# Altium schematic sheet Pixracer_V1_FMU_Alternative_2.SchDoc
size 287 x 183 mm; Origin: Eagle
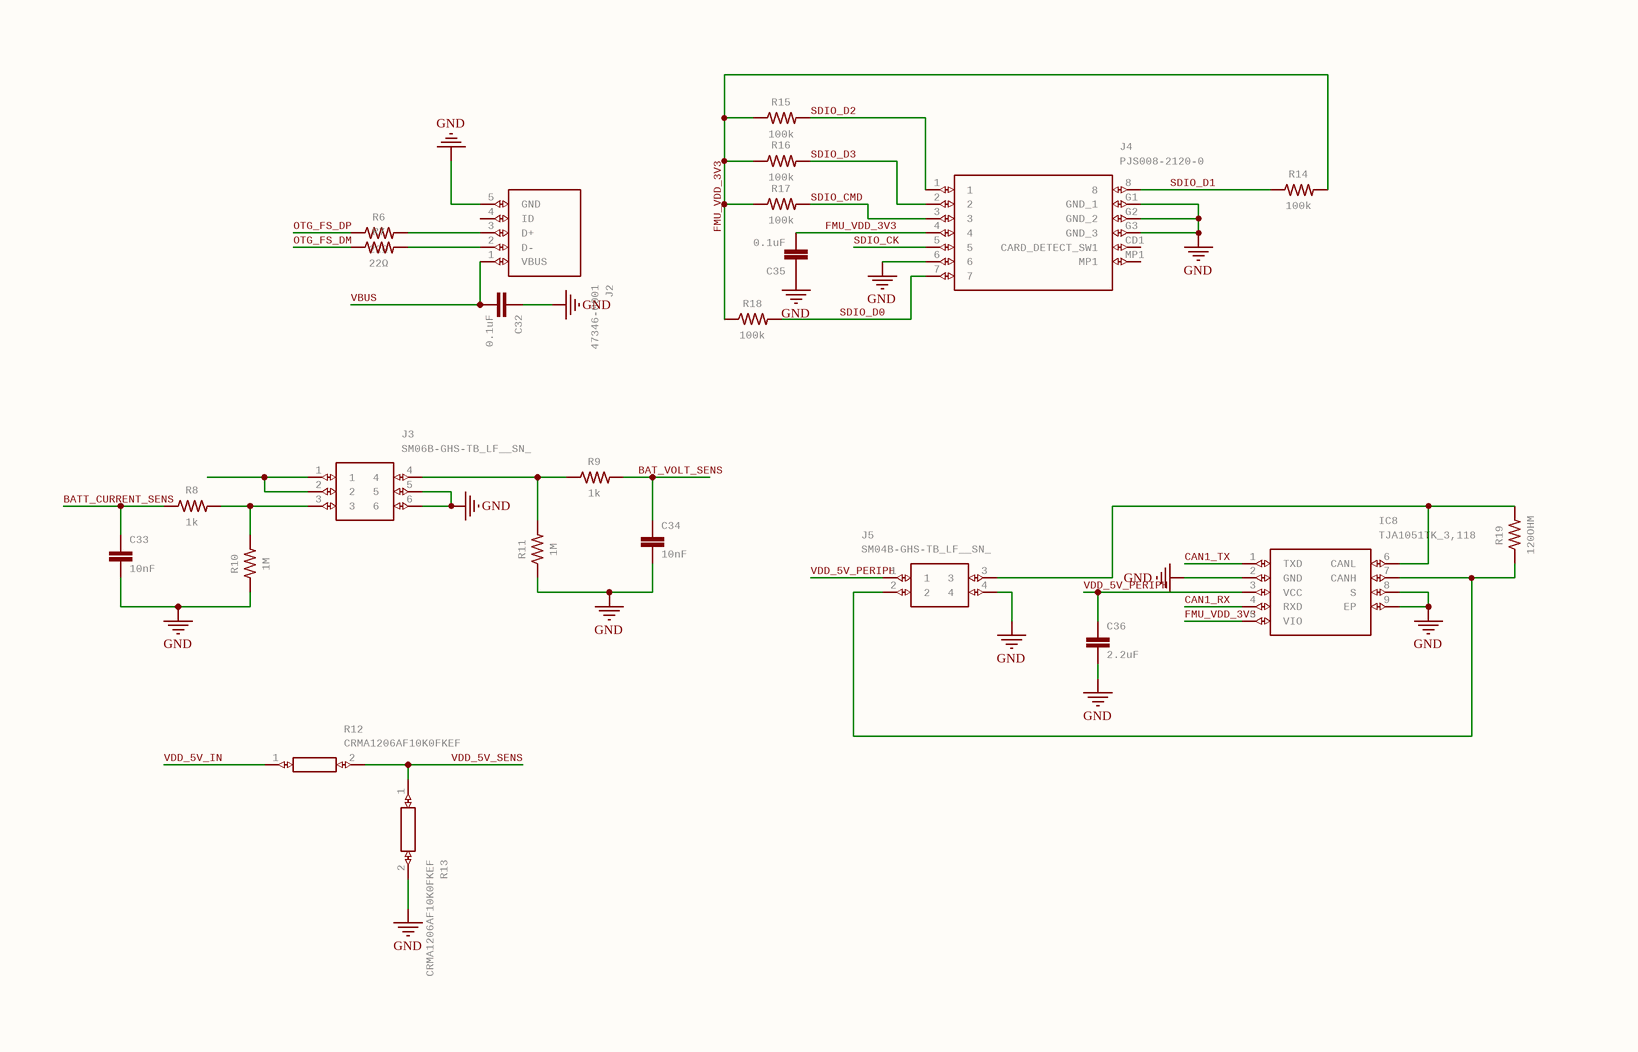
[diagram p0: Pixracer_V1_FMU_Alternative_2.SchDoc]

## Parts
C32  0.1uF  [0603]
C33  10nF  [0603]
C34  10nF  [0603]
C35  0.1uF  [0603]
C36  2.2uF  [1206]
IC8  TJA1051TK_3,118  [SON65P300X300X100-9N]
J2  47346-0001  [47346-0001]
J3  SM06B-GHS-TB_LF__SN_  [SM06B-GHS-TB]
J4  PJS008-2120-0  [PJS00821200]
J5  SM04B-GHS-TB_LF__SN_  [SM04B-GHS-TB]
R6  22Ω  [0603]
R7  22Ω  [0603]
R8  1k  [0603]
R9  1k  [0603]
R10  1M  [0603]
R11  1M  [0603]
R12  CRMA1206AF10K0FKEF  [RESC3216X74N]
R13  CRMA1206AF10K0FKEF  [RESC3216X74N]
R14  100k  [0603]
R15  100k  [0603]
R16  100k  [0603]
R17  100k  [0603]
R18  100k  [0603]
R19  120OHM  [0603]

## Nets
GND: C32.1 C33.2 C34.2 C35.1 C36.2 IC8.2(GND) IC8.8(S) IC8.9(EP) J2.5(GND) J3.5 J3.6 J4.6 J4.G1(GND_1) J4.G2(GND_2) J4.G3(GND_3) J5.4 R10.1 R11.1 R13.2
BAT_VOLT_SENS: C34.1 R9.2
BATT_CURRENT_SENS: C33.1 R8.1
CAN1_RX: IC8.4(RXD)
CAN1_TX: IC8.1(TXD)
FMU_VDD_3V3: C35.2 IC8.5(VIO) J4.4 R14.2 R15.1 R16.1 R17.1 R18.1
OTG_FS_DM: R7.1
OTG_FS_DP: R6.1
SDIO_CK: J4.5
SDIO_CMD: J4.3 R17.2
SDIO_D0: J4.7 R18.2
SDIO_D1: J4.8 R14.1
SDIO_D2: J4.1 R15.2
SDIO_D3: J4.2 R16.2
VBUS: C32.2 J2.1(VBUS)
VDD_5V_IN: R12.1
VDD_5V_PERIPH: C36.1 IC8.3(VCC) J5.1
VDD_5V_SENS: R12.2 R13.1
NetIC8_6: IC8.6(CANL) J5.3 R19.2
NetIC8_7: IC8.7(CANH) J5.2 R19.1
NetJ2_2: J2.2(D-) R7.2
NetJ2_3: J2.3(D+) R6.2
NetJ3_1: J3.1 J3.2
NetJ3_3: J3.3 R8.2 R10.2
NetJ3_4: J3.4 R9.1 R11.2

Not connected (* = marked no-connect by the designer): J2 4(ID); J4 CD1(CARD_DETECT_SW1) MP1

## Library data of the parts
C32 C35 = 0.1UF-0603-100V-10%-X7R-WE: 0.1ÂµF ceramic capacitors    A capacitor is a passive two-terminal electrical component used to store electrical energy temporarily in an electric field.; GateName_1: G$1; SymbolName_1: CAP; PROD_ID: CAP-16436; DeviceName: -0603-100V-10%-X7R-WE; LibraryName: SparkFun-Capacitors; DeviceSetName: 0.1UF
C33 C34 = 10NF-0603-50V-10%: 0.01uF/10nF/10,000pF ceramic capacitors    A capacitor is a passive two-terminal electrical component used to store electrical energy temporarily in an electric field.CAP-09321; GateName_1: G$1; SymbolName_1: CAP; PROD_ID: CAP-00867; DeviceName: -0603-50V-10%; LibraryName: SparkFun-Capacitors; DeviceSetName: 10NF
C36 = 2.2UF-1206-50V-10%: 2.2ÂµF ceramic capacitors    A capacitor is a passive two-terminal electrical component used to store electrical energy temporarily in an electric field.; GateName_1: G$1; SymbolName_1: CAP; PROD_ID: CAP-10009; DeviceName: -1206-50V-10%; LibraryName: SparkFun-Capacitors; DeviceSetName: 2.2UF
IC8 = TJA1051TK_3,118: High-speed CAN transceiver   Source:  Datasheet; MANUFACTURER_NAME: NXP; MANUFACTURER_PART_NUMBER: TJA1051TK/3,118; GateName_1: G$1; SymbolName_1: TJA1051TK_3,118; LibraryName: SamacSys_Parts; DeviceSetName: TJA1051TK_3,118; DESCRIPTION: High-speed CAN transceiver; HEIGHT: 1mm; MOUSER_PART_NUMBER: 771-TJA1051TK/3118; MOUSER_PRICE-STOCK: https://www.mouser.co.uk/ProductDetail/NXP-Semiconductors/TJA1051TK-3118?qs=fhAOlxDPaYVrDQ2e4g%252BBJA%3D%3D
J2 = 47346-0001: Micro USB B Receptacle Bottom Mount Assy Molex Right Angle SMT Type B Version 2.0 Micro USB Connector Socket, 30 V ac, 1A 47352 MICRO-USB   Source:  Datasheet; GateName_1: G$1; SymbolName_1: 47346-0001; LibraryName: SamacSys_Parts; DeviceSetName: 47346-0001; DESCRIPTION: Micro USB B Receptacle Bottom Mount Assy Molex Right Angle SMT Type B Version 2.0 Micro USB Connector Socket, 30 V ac, 1A 47352 MICRO-USB; HEIGHT: mm; MANUFACTURER_NAME: Molex; MANUFACTURER_PART_NUMBER: 47346-0001; MOUSER_PART_NUMBER: 538-47346-0001; MOUSER_PRICE-STOCK: https://www.mouser.co.uk/ProductDetail/Molex/47346-0001?qs=c2CV6XM0DweJBWaSeyWeCw%3D%3D
J3 = SM06B-GHS-TB_LF__SN_: GH 1.25mm header side entry 6 way JST GH Series, 1.25mm Pitch 6 Way Right Angle PCB Header, Solder Termination, 1A   Source:  Datasheet; MANUFACTURER_NAME: JST (JAPAN SOLDERLESS TERMINALS); MANUFACTURER_PART_NUMBER: SM06B-GHS-TB(LF)(SN); GateName_1: G$1; SymbolName_1: SM06B-GHS-TB_LF__SN_; LibraryName: SamacSys_Parts; DeviceSetName: SM06B-GHS-TB_LF__SN_; DESCRIPTION: GH 1.25mm header side entry 6 way JST GH Series, 1.25mm Pitch 6 Way Right Angle PCB Header, Solder Termination, 1A; HEIGHT: mm; RS_PART_NUMBER: 7521800P; RS_PRICE-STOCK: http://uk.rs-online.com/web/p/products/7521800P
J4 = PJS008-2120-0: Memory Card Connectors STD MNT MICRO SD PUSH-PUSH, SMT CONN   Source:  Datasheet; MANUFACTURER_NAME: Yamaichi; GateName_1: G$1; SymbolName_1: PJS008-2120-0; LibraryName: SamacSys_Parts; DeviceSetName: PJS008-2120-0; DESCRIPTION: Memory Card Connectors STD MNT MICRO SD PUSH-PUSH, SMT CONN; HEIGHT: 1.5mm; MANUFACTURER_PART_NUMBER: PJS008-2120-0; MOUSER_PART_NUMBER: 945-PJS008-2120-0; MOUSER_PRICE-STOCK: https://www.mouser.co.uk/ProductDetail/Yamaichi-Electronics/PJS008-2120-0?qs=pDnM3xHIg41mTHT1wk7bvQ%3D%3D
J5 = SM04B-GHS-TB_LF__SN_: JST GH Series, 1.25mm Pitch 4 Way Right Angle PCB Header, Solder Termination, 1A   Source:  Datasheet; MANUFACTURER_NAME: JST (JAPAN SOLDERLESS TERMINALS); MANUFACTURER_PART_NUMBER: SM04B-GHS-TB(LF)(SN); GateName_1: G$1; SymbolName_1: SM04B-GHS-TB_LF__SN_; LibraryName: SamacSys_Parts; DeviceSetName: SM04B-GHS-TB_LF__SN_; DESCRIPTION: JST GH Series, 1.25mm Pitch 4 Way Right Angle PCB Header, Solder Termination, 1A; HEIGHT: mm; RS_PART_NUMBER: 7521797P; RS_PRICE-STOCK: http://uk.rs-online.com/web/p/products/7521797P
R6 R7 = 22OHM-0603-1/10W-1%: 22Î© resistor    A resistor is a passive two-terminal electrical component that implements electrical resistance as a circuit element. Resistors act to reduce current flow, and, at the same time, act to lower voltage levels within circuits. - Wikipedia; GateName_1: G$1; DeviceSetName: 22OHM; PROD_ID: RES-08698; SymbolName_1: RESISTOR; DeviceName: -0603-1/10W-1%; LibraryName: SparkFun-Resistors
R8 R9 = 1KOHM-0603-1/10W-1%: 1kÎ© resistor    A resistor is a passive two-terminal electrical component that implements electrical resistance as a circuit element. Resistors act to reduce current flow, and, at the same time, act to lower voltage levels within circuits. - Wikipedia; GateName_1: G$1; DeviceSetName: 1KOHM; PROD_ID: RES-07856; SymbolName_1: RESISTOR; DeviceName: -0603-1/10W-1%; LibraryName: SparkFun-Resistors
R10 R11 = 1MOHM-0603-1/4W-5%: 1MÎ© resistor    A resistor is a passive two-terminal electrical component that implements electrical resistance as a circuit element. Resistors act to reduce current flow, and, at the same time, act to lower voltage levels within circuits. - Wikipedia; GateName_1: G$1; DeviceSetName: 1MOHM; PROD_ID: RES-07868; SymbolName_1: RESISTOR; DeviceName: -0603-1/4W-5%; LibraryName: SparkFun-Resistors
R12 R13 = CRMA1206AF10K0FKEF: Thick Film Resistors - SMD 0.30W 10Kohm 1% AEC-Q200   Source:  Datasheet; MANUFACTURER_NAME: Vishay; GateName_1: G$1; SymbolName_1: CRMA1206AF10K0FKEF; LibraryName: SamacSys_Parts; DeviceSetName: CRMA1206AF10K0FKEF; DESCRIPTION: Thick Film Resistors - SMD 0.30W 10Kohm 1% AEC-Q200; HEIGHT: 0.74mm; MANUFACTURER_PART_NUMBER: CRMA1206AF10K0FKEF; MOUSER_PART_NUMBER: 71-CRMA1206AF10K0FKF; MOUSER_PRICE-STOCK: https://www.mouser.co.uk/ProductDetail/Vishay/CRMA1206AF10K0FKEF?qs=TiOZkKH1s2Q81nOs5FD1Wg%3D%3D
R14-R18 = 100KOHM-0603-1/10W-1%: 100kÎ© resistor    A resistor is a passive two-terminal electrical component that implements electrical resistance as a circuit element. Resistors act to reduce current flow, and, at the same time, act to lower voltage levels within circuits. - Wikipedia; GateName_1: G$1; PROD_ID: RES-07828; SymbolName_1: RESISTOR; DeviceName: -0603-1/10W-1%; LibraryName: SparkFun-Resistors; DeviceSetName: 100KOHM
R19 = 120OHM: 120Î© resistor    A resistor is a passive two-terminal electrical component that implements electrical resistance as a circuit element. Resistors act to reduce current flow, and, at the same time, act to lower voltage levels within circuits. - Wikipedia; GateName_1: G$1; SymbolName_1: RESISTOR; LibraryName: SparkFun-Resistors; DeviceSetName: 120OHM